# EAGLE design input selector (EAGLE 6.4)
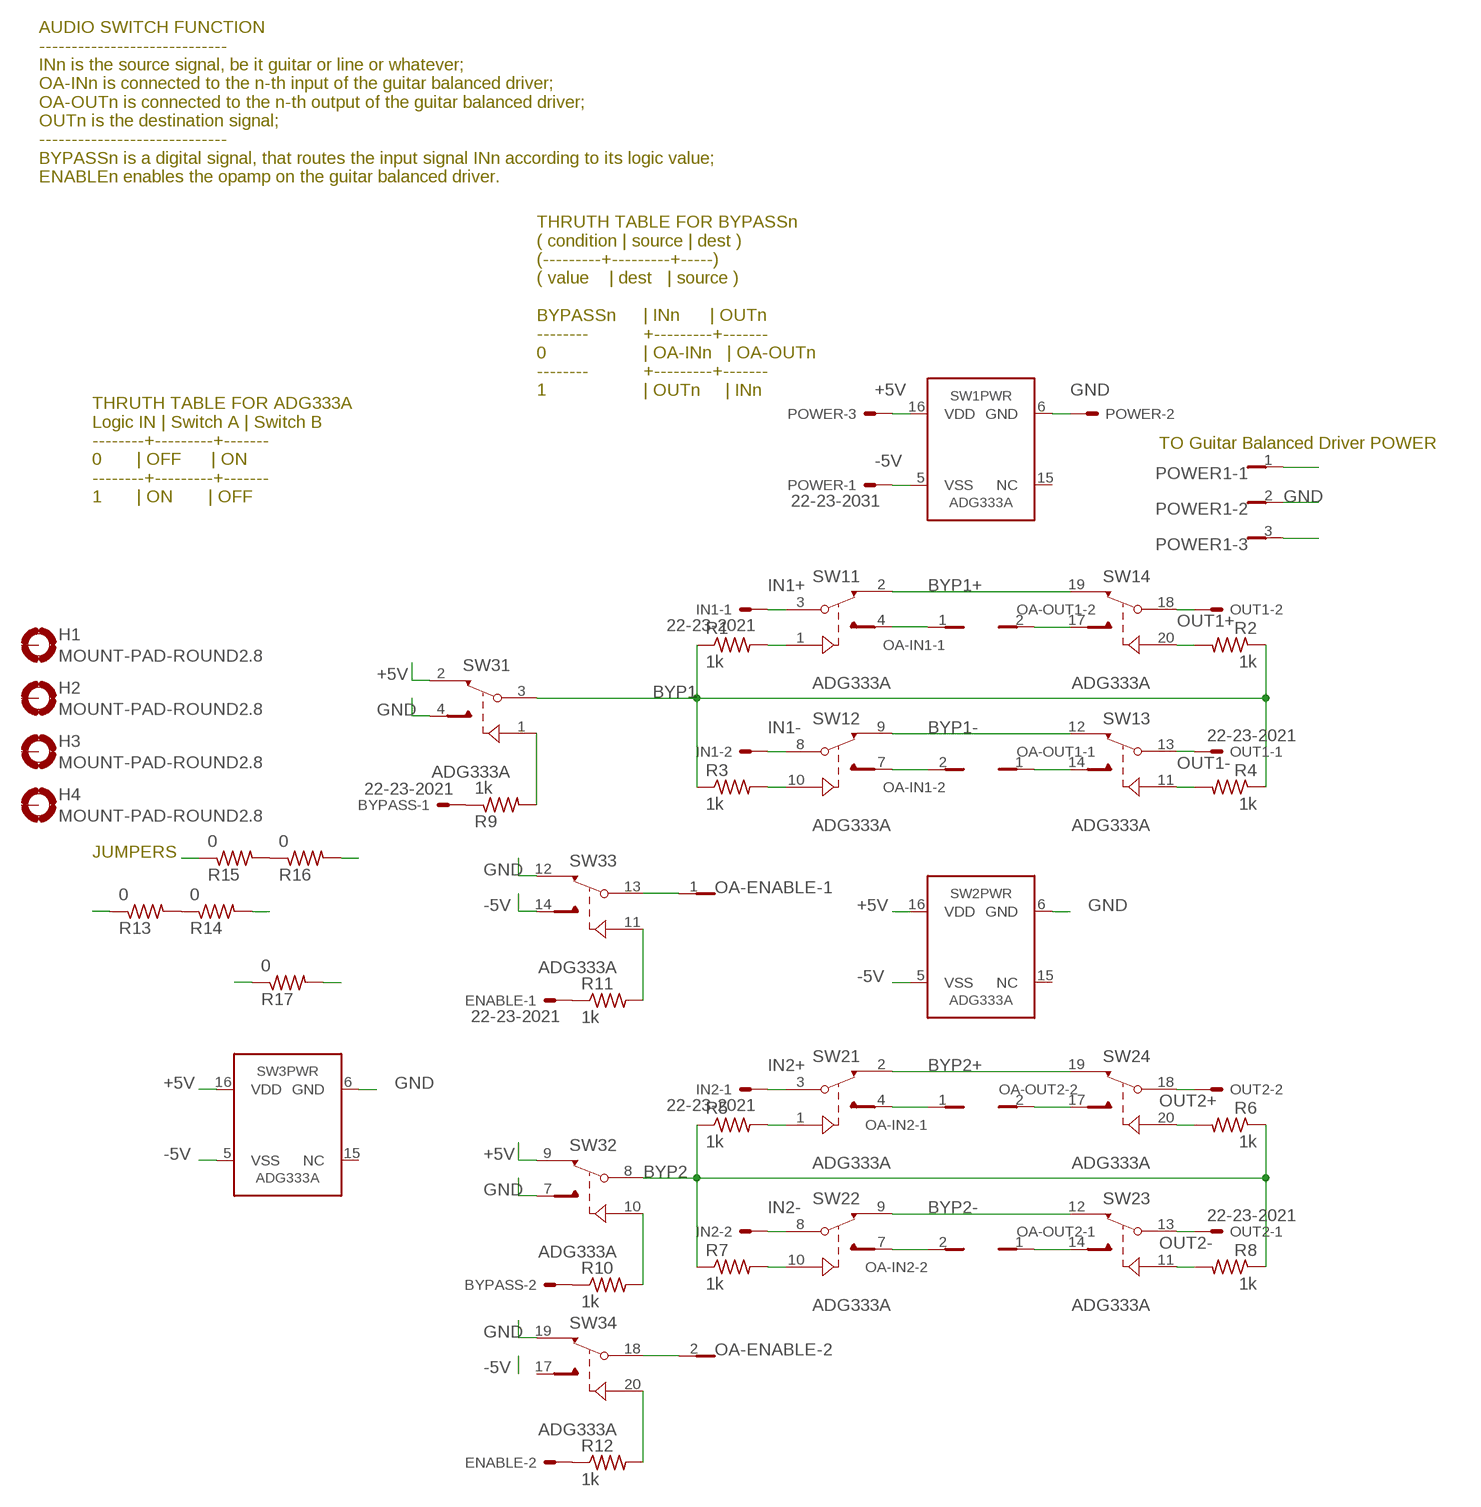
[diagram p0: schematic, sheet 1]

## Parts
BYPASS  22-23-2021  [22-23-2021]
ENABLE  22-23-2021  [22-23-2021]
H1  MOUNT-PAD-ROUND2.8  [2,8-PAD]
H2  MOUNT-PAD-ROUND2.8  [2,8-PAD]
H3  MOUNT-PAD-ROUND2.8  [2,8-PAD]
H4  MOUNT-PAD-ROUND2.8  [2,8-PAD]
IN1  22-23-2021  [22-23-2021]
IN2  22-23-2021  [22-23-2021]
OA-ENABLE  FE02-1  [FE02-1]
OA-IN1  FE02-1  [FE02-1]
OA-IN2  FE02-1  [FE02-1]
OA-OUT1  FE02-1  [FE02-1]
OA-OUT2  FE02-1  [FE02-1]
OUT1  22-23-2021  [22-23-2021]
OUT2  22-23-2021  [22-23-2021]
POWER  22-23-2031  [22-23-2031]
POWER1  FE03-1  [FE03-1]
R1  1k  R-US_R0603  [R0603]
R2  1k  R-US_R0603  [R0603]
R3  1k  R-US_R0603  [R0603]
R4  1k  R-US_R0603  [R0603]
R5  1k  R-US_R0603  [R0603]
R6  1k  R-US_R0603  [R0603]
R7  1k  R-US_R0603  [R0603]
R8  1k  R-US_R0603  [R0603]
R9  1k  R-US_R0603  [R0603]
R10  1k  R-US_R0603  [R0603]
R11  1k  R-US_R0603  [R0603]
R12  1k  R-US_R0603  [R0603]
R13  0  R-US_R0603  [R0603]
R14  0  R-US_R0603  [R0603]
R15  0  R-US_R0603  [R0603]
R16  0  R-US_R0603  [R0603]
R17  0  R-US_R0603  [R0603]
SW1  ADG333A  [SSOP20]
SW2  ADG333A  [SSOP20]
SW3  ADG333A  [SSOP20]

## Nets
+5V: POWER1.1 POWER.3 R17.1 R17.2 SW1.16(PWR:VDD) SW2.16(PWR:VDD) SW3.2(1:A) SW3.9(2:A) SW3.16(PWR:VDD)
-5V: POWER1.3 POWER.1 SW1.5(PWR:VSS) SW2.5(PWR:VSS) SW3.5(PWR:VSS) SW3.14(3:B)
BYP1: R1.1 R2.1 R3.1 R4.1 R13.1 R14.2 SW3.3(1:D)
BYP1+: SW1.2(1:A) SW1.19(4:A)
BYP1-: SW1.9(2:A) SW1.12(3:A)
BYP2: R5.1 R6.1 R7.1 R8.1 R15.1 R16.2 SW3.8(2:D)
BYP2+: SW2.2(1:A) SW2.19(4:A)
BYP2-: SW2.9(2:A) SW2.12(3:A)
GND: POWER1.2 POWER.2 SW1.6(PWR:GND) SW2.6(PWR:GND) SW3.4(1:B) SW3.6(PWR:GND) SW3.7(2:B) SW3.12(3:A) SW3.19(4:A)
IN1+: IN1.1 SW1.3(1:D)
IN1-: IN1.2 SW1.8(2:D)
IN2+: IN2.1 SW2.3(1:D)
IN2-: IN2.2 SW2.8(2:D)
N$1: ENABLE.2 R12.1
N$2: R1.2 SW1.1(1:IN)
N$3: R5.2 SW2.1(1:IN)
N$4: R3.2 SW1.10(2:IN)
N$5: ENABLE.1 R11.1
N$6: R7.2 SW2.10(2:IN)
N$7: OA-ENABLE.2 SW3.18(4:D)
N$8: OA-ENABLE.1 SW3.13(3:D)
N$9: R9.2 SW3.1(1:IN)
N$10: R10.2 SW3.10(2:IN)
N$11: R11.2 SW3.11(3:IN)
N$12: R12.2 SW3.20(4:IN)
N$13: OA-IN1.1 SW1.4(1:B)
N$14: R15.2 R16.1
N$15: R13.2 R14.1
N$18: R6.2 SW2.20(4:IN)
N$20: R2.2 SW1.20(4:IN)
N$21: R8.2 SW2.11(3:IN)
N$22: R4.2 SW1.11(3:IN)
N$33: BYPASS.1 R9.1
N$34: BYPASS.2 R10.1
OA-IN1-: OA-IN1.2 SW1.7(2:B)
OA-IN2+: OA-IN2.1 SW2.4(1:B)
OA-IN2-: OA-IN2.2 SW2.7(2:B)
OA-OUT1: OA-OUT1.1 SW1.14(3:B)
OA-OUT1+: OA-OUT1.2 SW1.17(4:B)
OA-OUT2+: OA-OUT2.2 SW2.17(4:B)
OA-OUT2-: OA-OUT2.1 SW2.14(3:B)
OUT1+: OUT1.2 SW1.18(4:D)
OUT1-: OUT1.1 SW1.13(3:D)
OUT2+: OUT2.2 SW2.18(4:D)
OUT2-: OUT2.1 SW2.13(3:D)
Unconnected: H1.B2,8(MOUNT) H2.B2,8(MOUNT) H3.B2,8(MOUNT) H4.B2,8(MOUNT) SW1.15(PWR:NC) SW2.15(PWR:NC) SW3.15(PWR:NC) SW3.17(4:B)

## Notes on the sheet
- AUDIO SWITCH FUNCTION
  -----------------------------
  INn is the source signal, be it guitar or line or whatever;
  OA-INn is connected to the n-th input of the guitar balanced driver;
  OA-OUTn is connected to the n-th output of the guitar balanced driver;
  OUTn is the destination signal;
  -----------------------------
  BYPASSn is a digital signal, that routes the input signal INn according to its logic value;
  ENABLEn enables the opamp on the guitar balanced driver.
- THRUTH TABLE FOR BYPASSn
  ( condition | source | dest )
  (---------+---------+-----)
  ( value    | dest   | source )
  
  BYPASSn
  --------
  0       
  --------
  1
- | INn      | OUTn
  +---------+-------
  | OA-INn   | OA-OUTn
  +---------+-------
  | OUTn     | INn
- TO Guitar Balanced Driver POWER
- THRUTH TABLE FOR ADG333A
  Logic IN | Switch A | Switch B
  --------+---------+-------
  0       | OFF      | ON
  --------+---------+-------
  1       | ON       | OFF
- JUMPERS

## Library data of the parts
BYPASS ENABLE IN1 IN2 OUT1 OUT2 = con-molex:22-23-2021: .100" (2.54mm) Center Header - 2 Pin; MF: MOLEX; MPN: 22-23-2021; OC_FARNELL: 1462926; OC_NEWARK: 25C3832
H1-H4 = holes:MOUNT-PAD-ROUND: MOUNTING PAD, round
OA-ENABLE OA-IN1 OA-IN2 OA-OUT1 OA-OUT2 = con-lsta:FE02-1: FEMALE HEADER Compatible with C-GRID III headers from MOLEX (90147 series)
POWER = con-molex:22-23-2031: .100" (2.54mm) Center Header - 3 Pin; MF: MOLEX; MPN: 22-23-2031; OC_FARNELL: 1462950; OC_NEWARK: 30C0862
POWER1 = con-lsta:FE03-1
R1-R17 = rcl:R-US_: RESISTOR, American symbol
SW1-SW3 = analog-devices:ADG333A

## Board
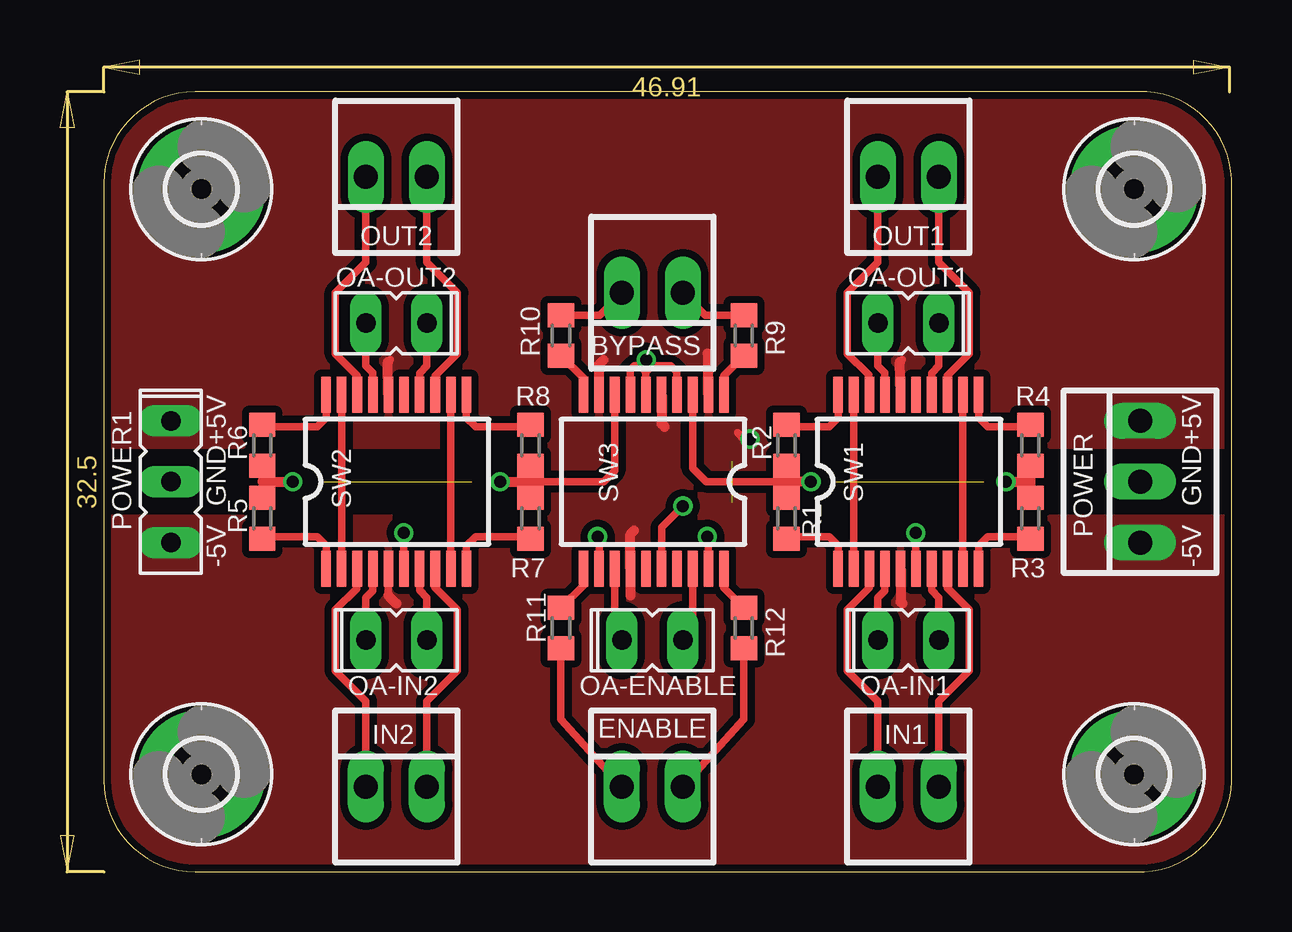
[diagram p1: board, top side]
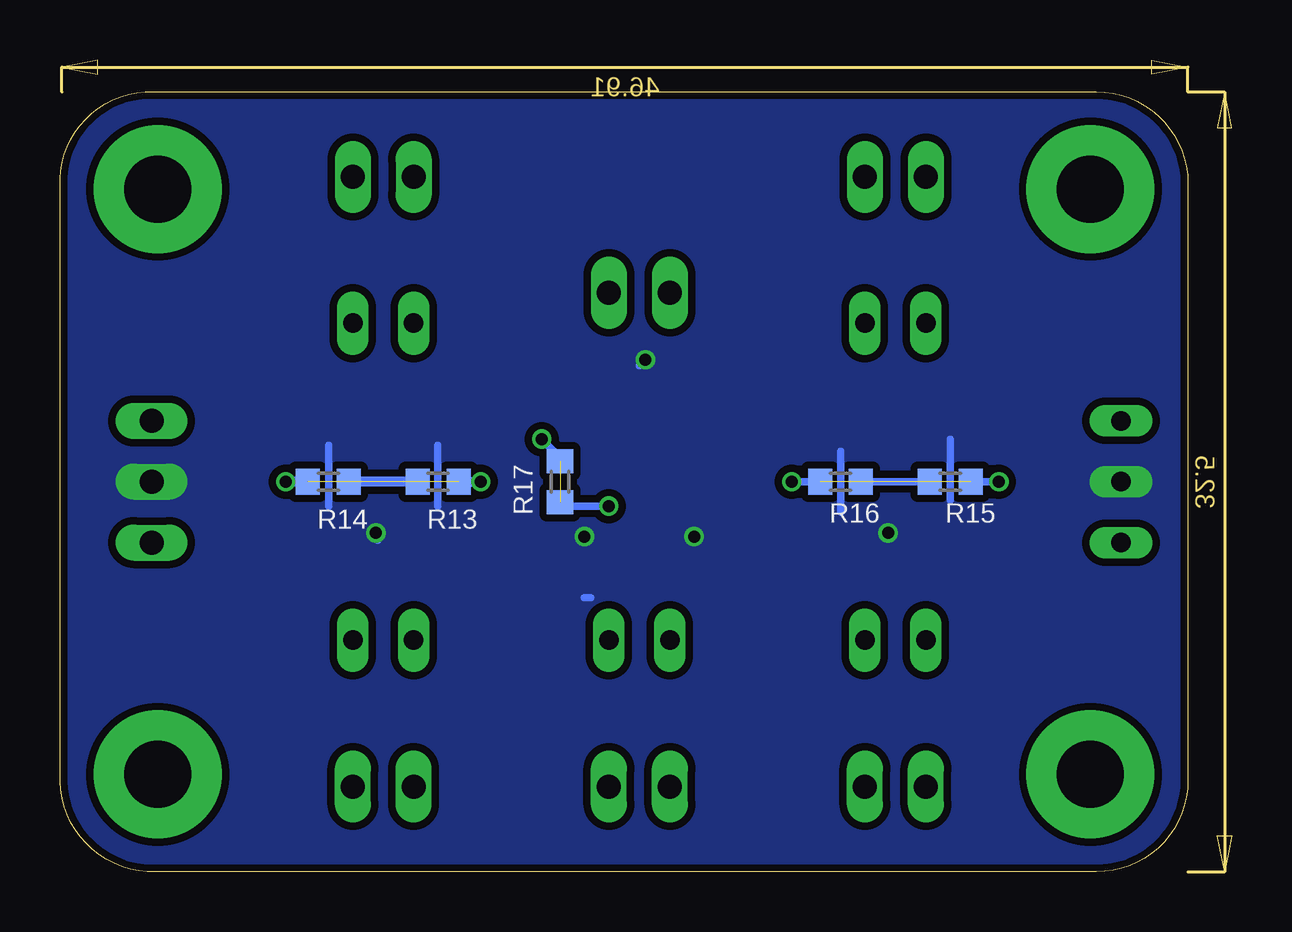
[diagram p2: board, bottom side, seen from below]

Size 47 x 32.5 mm. Coordinates in mm from the lower left corner, seen from the top.
Outline: 3.81,0 43.36,0 arc90 46.99,4.14 46.99,28.87 arc90 43.1,32.5 3.81,32.5 arc90 0,28.69 0,3.81 arc90 3.81,0
Copper layers (1*16): Top 0.035mm / dielectric 1.5mm / Bottom 0.035mm
Design rules "Fusion_eagle_rule_v1.1": minimum track width 6mil, minimum drill 12mil, track to track 6mil, track to pad 6mil, pad to pad 6mil, via to via 6mil, smd to smd 0mil, copper to edge 10mil, drill to drill 10mil, minimum pad ring 10mil, minimum via ring 6mil, stop-mask expansion 2mil, vias tented up to drill 100mil, thermal gap 10mil

### Footprints (pad centres in the part's own frame; a part is rotated, then mirrored left to right if it is on the bottom)
22-23-2021 = drill 1 long: 1 -1.27,0; 2 1.27,0
2,8-PAD = drill 2.8 pad 5.334: B2,8 0,0
FE02-1 = drill 0.813 long: 1 -1.27,0; 2 1.27,0
22-23-2031 = drill 1 long: 1 -2.54,0; 2 0,0; 3 2.54,0
FE03-1 = drill 0.813 long: 1 -2.54,0; 2 0,0; 3 2.54,0
R0603 = smd 1 x 1.1: 1 -0.85,0; 2 0.85,0
SSOP20 = smd 0.4 x 1.5: 1 -4.225,-3.625; 2 -3.575,-3.625; 3 -2.925,-3.625; 4 -2.275,-3.625; 5 -1.625,-3.625; 6 -0.975,-3.625; 7 -0.325,-3.625; 8 0.325,-3.625; 9 0.975,-3.625; 10 1.625,-3.625; 11 1.625,3.625; 12 0.975,3.625; 13 0.325,3.625; 14 -0.325,3.625; 15 -0.975,3.625; 16 -1.625,3.625; 17 -2.275,3.625; 18 -2.925,3.625; 19 -3.575,3.625; 20 -4.225,3.625

### Placement (x,y rotation side)
BYPASS  22.86,24.13 180 top
ENABLE  22.86,3.56 0 top
H1  4.06,28.45 0 top
H2  4.06,4.06 0 top
H3  42.93,4.06 0 top
H4  42.93,28.45 0 top
IN1  33.53,3.56 0 top
IN2  12.19,3.56 0 top
OA-ENABLE  22.86,9.65 0 top
OA-IN1  33.53,9.65 0 top
OA-IN2  12.19,9.65 0 top
OA-OUT1  33.53,22.86 180 top
OA-OUT2  12.19,22.86 180 top
OUT1  33.53,28.96 180 top
OUT2  12.19,28.96 180 top
POWER  43.18,16.26 90 top
POWER1  2.79,16.26 270 top
R1  28.45,14.73 270 top
R2  28.45,17.78 90 top
R3  38.61,14.73 270 top
R4  38.61,17.78 90 top
R5  6.6,14.73 270 top
R6  6.6,17.78 90 top
R7  17.78,14.73 270 top
R8  17.78,17.78 90 top
R9  26.67,22.35 270 top
R10  19.05,22.35 270 top
R11  19.05,10.16 90 top
R12  26.67,10.16 90 top
R13  31.24,16.26 180 bottom
R14  35.81,16.26 180 bottom
R15  9.91,16.26 180 bottom
R16  14.48,16.26 180 bottom
R17  26.16,16.26 90 bottom
SW1  34.82,16.26 0 top
SW2  13.49,16.26 0 top
SW3  21.61,16.26 180 top

### Tracks (layer width: path | path; a pad name or v marks a point on that pad's centre or on a via)
+5V  (via drill 0.5)  (1 unrouted)
  Top 0.305: 33.17,21.23 33.27,21.34 | 11.84,21.23 11.94,21.34 | v26.92,18.03 26.67,18.03 26.42,18.29 | SW3.16 23.24,14.35 v24.13,15.24
  Top 0.406: SW1.16 33.17,21.23 | SW2.16 11.84,21.23 | 20.83,21.34 20.61,21.12 20.64,21.1 SW3.9 | SW3.2 25.19,21.55 25.15,21.59
  Bottom 0.305: R17.2 26,17.11 v26.92,18.03 | v24.13,15.24 25.74,15.24 R17.1
  pour Top (isolate 0.305, no thermals): 0,17.78 0,32.51 46.99,32.51 46.99,17.78 38.86,17.78 38.86,19.3 29.21,19.3 29.21,16.76 25.4,16.76 24.89,17.27 24.89,20.83 23.88,21.59 21.84,21.59 20.83,20.83 20.83,17.27 20.32,16.76 18.03,16.76 18.03,17.78
-5V
  Top 0.305: SW2.5 11.86,11.51
  Top 0.406: 21.94,11.53 SW3.14 21.94,14.07 22.1,14.22 | SW3.5 23.24,18.67 23.37,18.54 | SW1.5 33.2,11.25 33.27,11.18 | 11.86,11.51 12.19,11.18
  pour Top (isolate 0.305, no thermals): 0,14.73 18.03,14.73 18.03,15.75 21.08,15.75 21.84,16.51 21.84,20.32 23.88,20.32 23.88,16.76 24.89,15.75 29.21,15.75 29.21,13.46 38.86,13.46 38.86,14.73 46.99,14.73 46.99,0 0,0
BYP1  (via drill 0.5)  (1 unrouted)
  Top 0.305: SW3.3 24.54,16.82 25.09,16.26 28.45,16.26
  Top 0.406: R2.1 28.45,16.26 | 28.45,16.26 R1.1 | v29.46,16.26 28.45,16.26 | R4.1 38.61,16.26 | 38.61,16.26 R3.1 | v37.59,16.26 38.61,16.26 | SW3.3
  Bottom 0.406: R13.1 v29.46,16.26 | R14.2 v37.59,16.26
BYP1+
  Top 0.305: SW1.19 SW1.2
BYP1-
  Top 0.305: SW1.12 SW1.9
BYP2  (via drill 0.5)  (1 unrouted)
  Top 0.305: R6.1 6.6,16.26 R5.1 | SW3.8 21.29,16.72 20.83,16.26 17.78,16.26
  Top 0.406: 6.6,16.26 v7.87,16.26 | v16.51,16.26 17.78,16.26 | 17.78,16.26 R8.1 | 17.78,16.26 R7.1
  Bottom 0.305: v7.87,16.26 R15.1 | R16.2 v16.51,16.26
BYP2+
  Top 0.305: SW2.19 SW2.2
BYP2-
  Top 0.305: SW2.12 SW2.9
GND  (via drill 0.5)
  Top 0.305: 33.78,12.63 SW1.6 v33.82,14.12 v33.83,14.12 | SW2.6 12.49,14.11 v12.5,14.12 | 22.59,20.81 22.35,21.08 | 22.35,21.08 22.1,21.08 21.94,20.92 SW3.7 | SW3.6 22.59,20.81 | 22.59,20.81 22.86,21.08 23.62,21.08 23.88,20.83 23.88,19.89 SW3.4 | 22.35,21.08 v22.61,21.34 | SW3.12 20.64,13.9 v20.57,13.97 | SW3.19 25.19,13.93 v25.15,13.97
  Bottom 0.305: v33.83,14.12 33.76,13.82 | 25.15,11.43 24.89,11.43 | v22.61,21.34 22.86,21.08 | 31.25,17.78 31.25,15.24 | 35.8,17.78 35.8,15.24 | 9.91,18.03 9.91,15.49 | 14.46,17.53 14.46,14.99 | v20.57,13.97 20.57,14.22 | v25.15,13.97 24.89,13.97
  pour Bottom (isolate 0.305, no thermals): 0,32.51 46.99,32.51 46.99,0 0,0
IN1+
  Top 0.305: IN1.1 32.26,7.11 30.99,8.38 30.99,10.92 31.9,11.83 SW1.3
IN1-
  Top 0.305: IN1.2 34.8,7.11 36.07,8.38 36.07,10.92 35.15,11.84 SW1.8
IN2+
  Top 0.305: SW2.3 10.54,11.81 9.65,10.92 9.65,8.38 10.92,7.11 IN2.1
IN2-
  Top 0.305: SW2.8 13.79,11.87 14.73,10.92 14.73,8.38 13.46,7.11 IN2.2
N$1
  Top 0.305: R12.1 26.67,6.35 ENABLE.2
N$2
  Top 0.305: SW1.1 30.6,13.6 30.23,13.97 28.54,13.97 R1.2
N$3
  Top 0.305: SW2.1 9.26,13.6 8.89,13.97 6.69,13.97 R5.2
N$4
  Top 0.305: SW1.10 36.45,13.59 36.83,13.97 38.52,13.97 R3.2
N$5
  Top 0.305: R11.1 19.05,6.35 ENABLE.1
N$6
  Top 0.305: 15.11,12.61 SW2.10 15.11,13.59 15.49,13.97 17.69,13.97 R7.2
N$7
  Top 0.305: SW3.18 24.54,10.57 OA-ENABLE.2
N$8
  Top 0.305: SW3.13 21.29,10.46 OA-ENABLE.1
N$9
  Top 0.305: SW3.1 25.84,20.67 R9.2
N$10
  Top 0.305: SW3.10 19.99,20.56 R10.2
N$11
  Top 0.305: SW3.11 19.99,11.95 R11.2
N$12
  Top 0.305: SW3.20 25.84,11.84 R12.2
N$13
  Top 0.305: SW1.4 32.55,11.72 32.26,11.43 OA-IN1.1
N$14
  Bottom 0.305: R15.2 R16.1
N$15
  Bottom 0.406: R13.2 R14.1
N$18
  Top 0.305: SW2.20 9.26,18.91 8.89,18.54 6.69,18.54 R6.2
N$20
  Top 0.305: SW1.20 30.6,18.91 30.23,18.54 28.54,18.54 R2.2
N$21
  Top 0.305: SW2.11 15.11,18.92 15.49,18.54 17.69,18.54 R8.2
N$22
  Top 0.305: SW1.11 36.45,18.92 36.83,18.54 38.52,18.54 R4.2
N$33
  Top 0.305: R9.1 25.06,23.2 BYPASS.1
N$34
  Top 0.305: R10.1 20.66,23.2 BYPASS.2
OA-IN1-
  Top 0.305: SW1.7 34.5,11.73 34.8,11.43 OA-IN1.2
OA-IN2+
  Top 0.305: SW2.4 11.21,11.72 10.92,11.43 OA-IN2.1
OA-IN2-
  Top 0.305: SW2.7 13.16,11.73 13.46,11.43 OA-IN2.2
OA-OUT1
  Top 0.305: SW1.14 34.5,20.78 34.8,21.08 OA-OUT1.1
OA-OUT1+
  Top 0.305: SW1.17 32.55,20.79 32.26,21.08 OA-OUT1.2
OA-OUT2+
  Top 0.305: SW2.17 11.21,20.79 10.92,21.08 OA-OUT2.2
OA-OUT2-
  Top 0.305: SW2.14 13.16,20.78 13.46,21.08 OA-OUT2.1
OUT1+
  Top 0.305: SW1.18 31.87,19.91 31.87,20.7 30.99,21.59 30.99,24.13 32.26,25.4 OUT1.2
OUT1-
  Top 0.305: OUT1.1 34.8,25.4 36.07,24.13 36.07,21.59 35.15,20.67 SW1.13
OUT2+
  Top 0.305: OUT2.2 10.92,25.4 9.65,24.13 9.65,21.59 10.56,20.68 SW2.18
OUT2-
  Top 0.305: OUT2.1 13.46,25.4 14.73,24.13 14.73,21.59 13.81,20.67 SW2.13

### Text on the board
tNames: +5V | +5V | GND | GND | -5V | -5V